# Altium project 九键触摸面板-触摸板-V1.PrjPCB
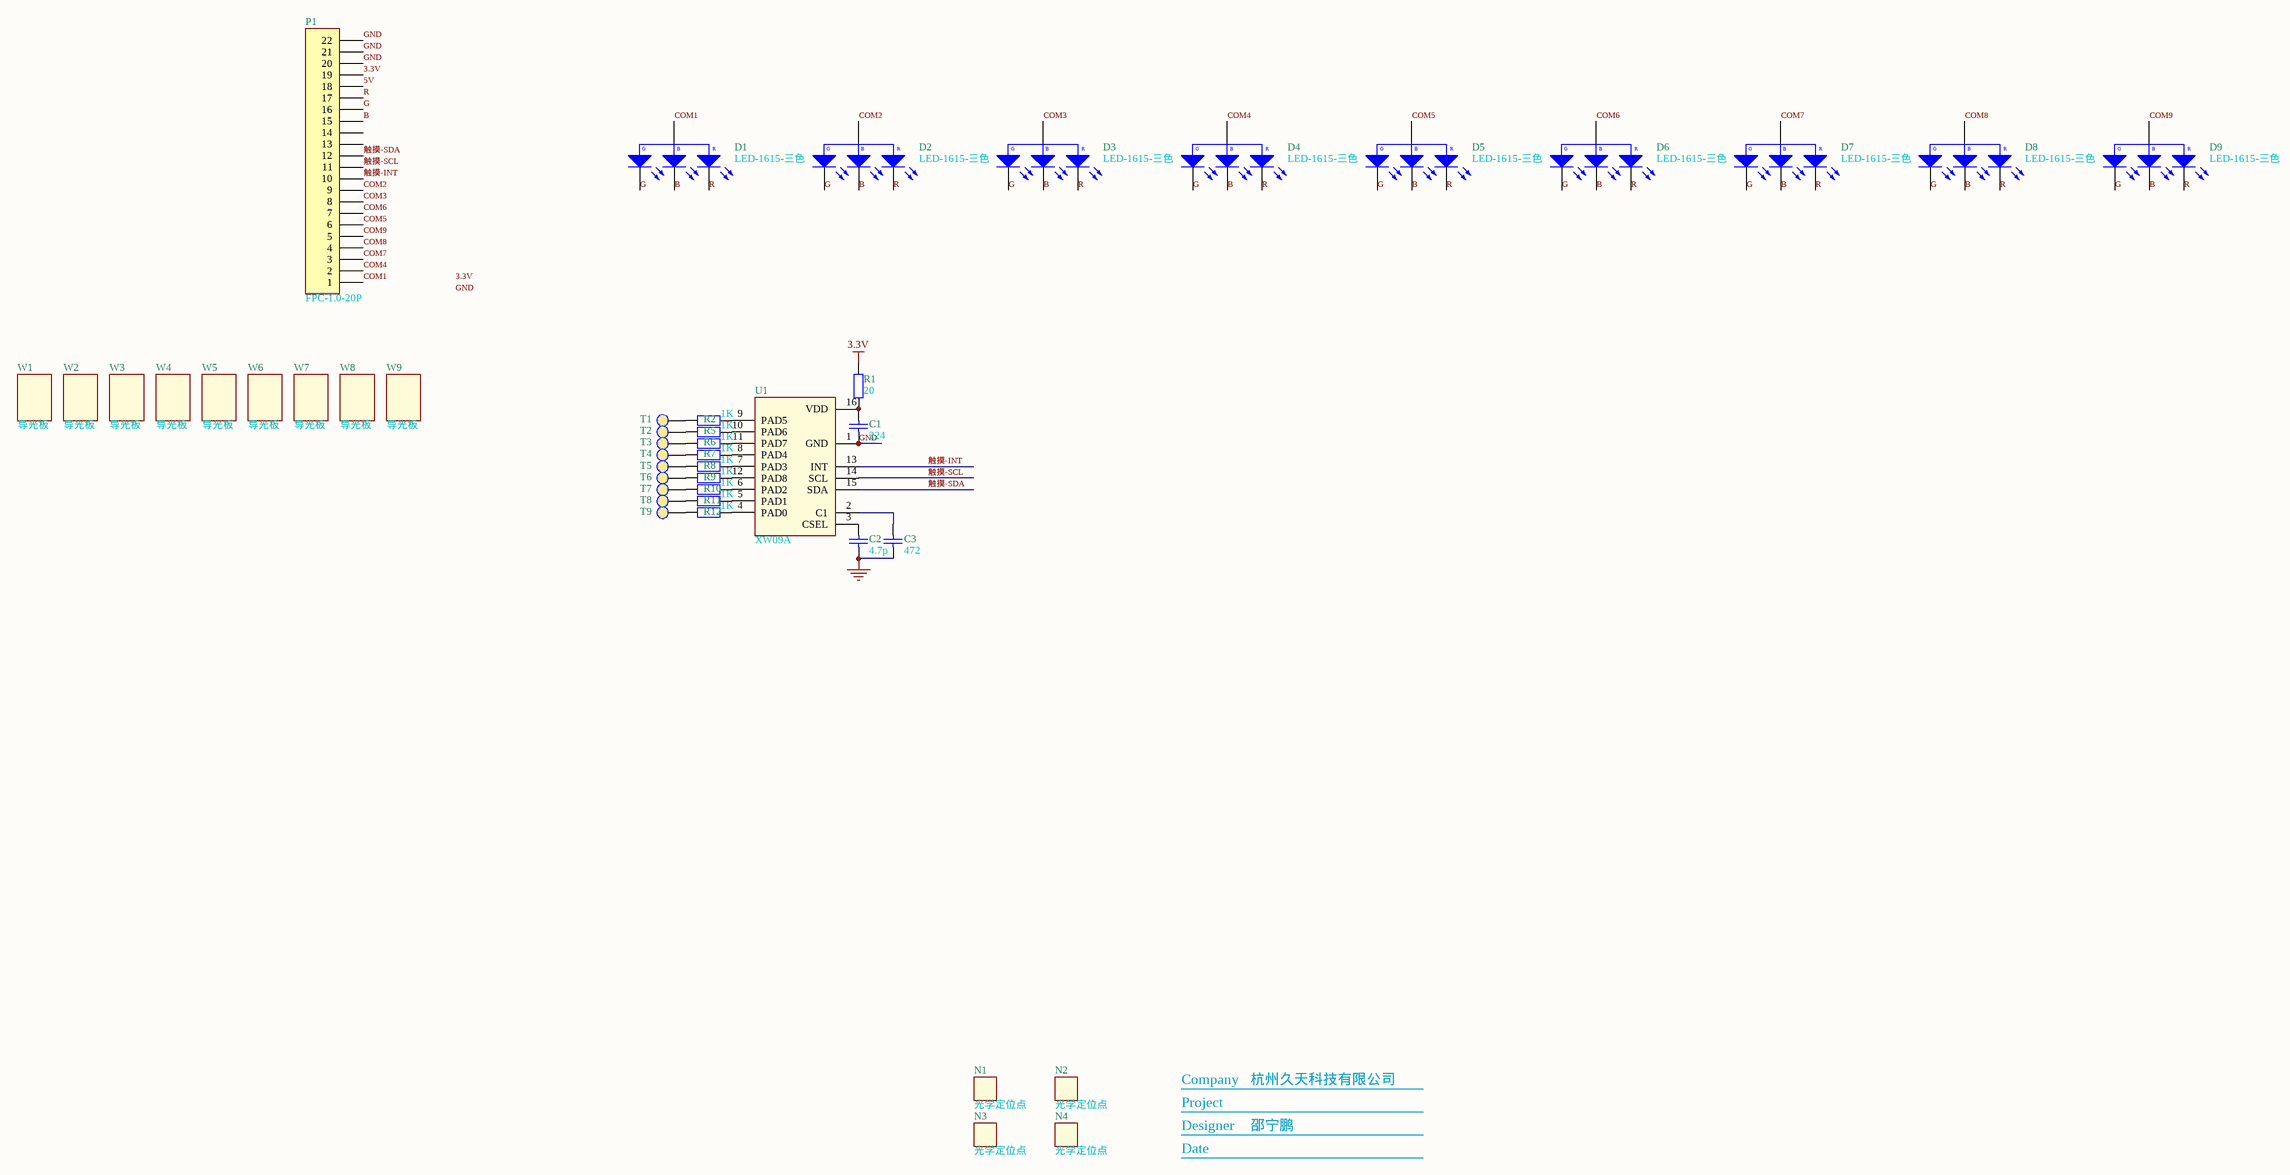
[diagram p0: 九键触摸面板-触摸板-V1.SchDoc]
1 sheet, 46 parts. Net scope: global (net labels, ports and power ports of the same name join across sheets).
Board file: 九键触摸面板-触摸板-V1.PcbDoc

## Sheet 九键触摸面板-触摸板-V1.SchDoc
size A1

### Parts
C1  224  [C-0603]
C2  4.7p  [C-0603]
C3  472  [C-0603]
D1  LED-1615-三色  [LED-1615-三色]
D2  LED-1615-三色  [LED-1615-三色]
D3  LED-1615-三色  [LED-1615-三色]
D4  LED-1615-三色  [LED-1615-三色]
D5  LED-1615-三色  [LED-1615-三色]
D6  LED-1615-三色  [LED-1615-三色]
D7  LED-1615-三色  [LED-1615-三色]
D8  LED-1615-三色  [LED-1615-三色]
D9  LED-1615-三色  [LED-1615-三色]
N1  光学定位点  [MARK-1mm-3mm]
N2  光学定位点  [MARK-1mm-3mm]
N3  光学定位点  [MARK-1mm-3mm]
N4  光学定位点  [MARK-1mm-3mm]
P1  FPC-1.0-20P  [FPC-1.0mm_20P下接翻盖]
R1  20  [R-0603]
R2  1K  [R-0603]
R5  1K  [R-0603]
R6  1K  [R-0603]
R7  1K  [R-0603]
R8  1K  [R-0603]
R9  1K  [R-0603]
R10  1K  [R-0603]
R11  1K  [R-0603]
R12  1K  [R-0603]
T1  (no value)  [焊点1mm]
T2  (no value)  [焊点1mm]
T3  (no value)  [焊点1mm]
T4  (no value)  [焊点1mm]
T5  (no value)  [焊点1mm]
T6  (no value)  [焊点1mm]
T7  (no value)  [焊点1mm]
T8  (no value)  [焊点1mm]
T9  (no value)  [焊点1mm]
U1  XW09A  [SOP-16-M]
W1  导光板  [导光板20.5*15*2]
W2  导光板  [导光板20.5*15*2]
W3  导光板  [导光板20.5*15*2]
W4  导光板  [导光板20.5*15*2]
W5  导光板  [导光板20.5*15*2]
W6  导光板  [导光板20.5*15*2]
W7  导光板  [导光板20.5*15*2]
W8  导光板  [导光板20.5*15*2]
W9  导光板  [导光板20.5*15*2]

### Nets
3.3V: P1.19 R1.1
GND: C1.1 C2.1 C3.1 P1.20 P1.21 P1.22 U1.1(GND)
5V: P1.18
B: D1.4(G) D2.4(G) D3.4(G) D4.4(G) D5.4(G) D6.4(G) D7.4(G) D8.4(G) D9.4(G) P1.15
COM1: D1.2(A) P1.1
COM2: D2.2(A) P1.9
COM3: D3.2(A) P1.8
COM4: D4.2(A) P1.2
COM5: D5.2(A) P1.6
COM6: D6.2(A) P1.7
COM7: D7.2(A) P1.3
COM8: D8.2(A) P1.4
COM9: D9.2(A) P1.5
G: D1.1(R) D2.1(R) D3.1(R) D4.1(R) D5.1(R) D6.1(R) D7.1(R) D8.1(R) D9.1(R) P1.16
R: D1.3(B) D2.3(B) D3.3(B) D4.3(B) D5.3(B) D6.3(B) D7.3(B) D8.3(B) D9.3(B) P1.17
触摸-INT: P1.10 U1.13(INT)
触摸-SCL: P1.11 U1.14(SCL)
触摸-SDA: P1.12 U1.15(SDA)
NetC1_2: C1.2 R1.2 U1.16(VDD)
NetC2_2: C2.2 U1.3(CSEL)
NetC3_2: C3.2 U1.2(C1)
NetR2_1: R2.1 U1.9(PAD5)
NetR2_2: R2.2 T1.1
NetR5_1: R5.1 U1.10(PAD6)
NetR5_2: R5.2 T2.1
NetR6_1: R6.1 U1.11(PAD7)
NetR6_2: R6.2 T3.1
NetR7_1: R7.1 U1.8(PAD4)
NetR7_2: R7.2 T4.1
NetR8_1: R8.1 U1.7(PAD3)
NetR8_2: R8.2 T5.1
NetR9_1: R9.1 U1.12(PAD8)
NetR9_2: R9.2 T6.1
NetR10_1: R10.1 U1.6(PAD2)
NetR10_2: R10.2 T7.1
NetR11_1: R11.1 U1.5(PAD1)
NetR11_2: R11.2 T8.1
NetR12_1: R12.1 U1.4(PAD0)
NetR12_2: R12.2 T9.1

Not connected (* = marked no-connect by the designer): P1 13 14

### Notes on the sheet
- Company
- 杭州久天科技有限公司
- Project
- Designer
- Date
- 邵宁鹏
- Labels drawn without touching a wire or pin: 3.3V, GND

### Library data of the parts
C1-C3 = Cap-0603: 0805; Published: 8-Jun-2000; LatestRevisionDate: 17-Jul-2002; LatestRevisionNote: Re-released for DXP Platform.; PackageReference: RAD-0.3; Publisher: Altium Limited
N1-N4 = 无引脚
P1 = Header 22: Header, 22-Pin; LatestRevisionDate: 17-Jul-2002; LatestRevisionNote: Re-released for DXP Platform.; Publisher: Altium Limited
R1 R2 R5-R12 = Res2-0603: 0603; Published: 8-Jun-2000; LatestRevisionDate: 17-Jul-2002; LatestRevisionNote: Re-released for DXP Platform.; PackageReference: AXIAL-0.4; Publisher: Altium Limited
T1-T9 = 测试点